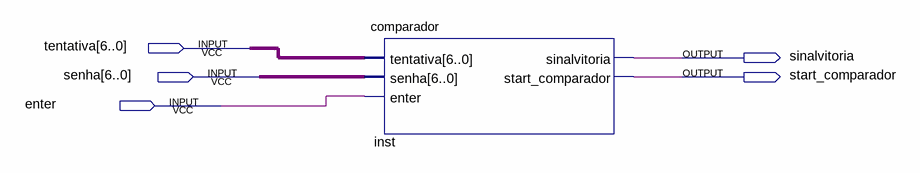
[diagram p0: schematic sheet]
// Quartus schematic esquematicotestecomparador.bdf as structural Verilog: 1 symbols, 5 pins
module esquematicotestecomparador (
  input  [6:0] tentativa,
  input  [6:0] senha,
  input  enter,
  output sinalvitoria,
  output start_comparador
);

  comparador inst (
    .tentativa(tentativa), .senha(senha), .enter(enter), .sinalvitoria(sinalvitoria),
    .start_comparador(start_comparador));
endmodule
